# Altium schematic sheet rev2.SchDoc: RFM9x
size A4; CompanyName: LoRaWan Thailand; DrawnBy: TouYunG
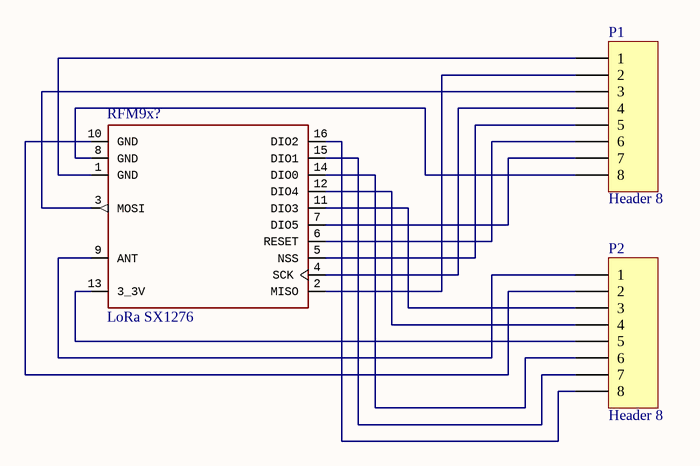
[diagram p0: rev2.SchDoc]

## Parts
P1  Header 8  [HDR1X8]
P2  Header 8  [HDR1X8]
RFM9x?  LoRa SX1276  [XCVR_RFM95W-868S2]

## Nets
NetP1_1: P1.1 RFM9x?.1(GND)
NetP1_2: P1.2 RFM9x?.2(MISO)
NetP1_3: P1.3 RFM9x?.3(MOSI)
NetP1_4: P1.4 RFM9x?.4(SCK)
NetP1_5: P1.5 RFM9x?.5(NSS)
NetP1_6: P1.6 RFM9x?.6(RESET)
NetP1_7: P1.7 RFM9x?.7(DIO5)
NetP1_8: P1.8 RFM9x?.8(GND)
NetP2_1: P2.1 RFM9x?.9(ANT)
NetP2_2: P2.2 RFM9x?.10(GND)
NetP2_3: P2.3 RFM9x?.11(DIO3)
NetP2_4: P2.4 RFM9x?.12(DIO4)
NetP2_5: P2.5 RFM9x?.13(3_3V)
NetP2_6: P2.6 RFM9x?.14(DIO0)
NetP2_7: P2.7 RFM9x?.15(DIO1)
NetP2_8: P2.8 RFM9x?.16(DIO2)

## Notes on the sheet
- Title
- Size:
- Date:
- A4
- Number:
- Time:
- Revision:
- Sheet
- of
- File:

## Library data of the parts
P1 P2 = Header 8: Header, 8-Pin; LatestRevisionDate: 17-Jul-2002; LatestRevisionNote: Re-released for DXP Platform.; Publisher: Altium Limited
RFM9x? = RFM95W-868S2: MF: RF; Package: SMD-16 Hope Microelectronics; Price: 7.72 USD; Availability: Unavailable; MP: RFM95W-868S2